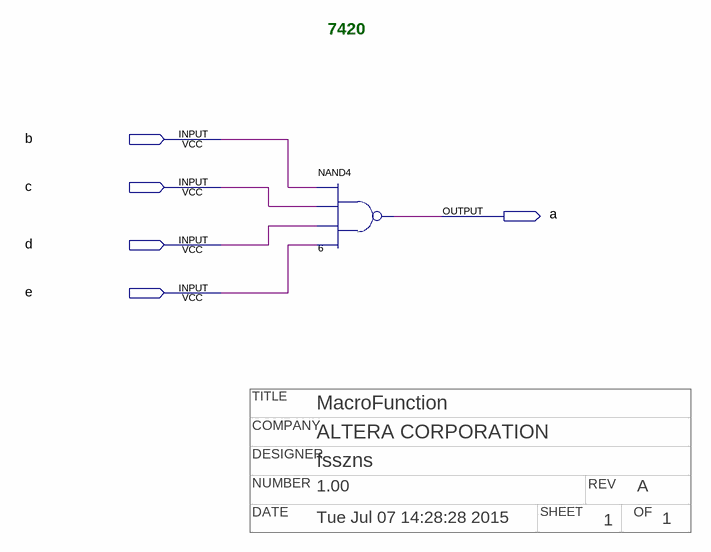
[diagram p0: schematic sheet]
// Quartus schematic a74240.bdf as structural Verilog: 1 symbols, 5 pins
// Title block: TITLE: MacroFunction; COMPANY: ALTERA CORPORATION; DESIGNER: fsszns; NUMBER: 1.00; REV: A; DATE: Tue Jul 07 14:28:28 2015; SHEET: 1; OF: 1
module a74240 (
  input  b,
  input  c,
  input  d,
  input  e,
  output a
);

  nand u_6 (a, b, c, d, e);

  // Notes on the sheet:
  //   7420
endmodule
